# EasyEDA schematic SCH_esp32s-Camper_2025-03-08.json
TITLE: Centralita calefaccion camper; REV: 1.0; Date: 2024-12-25; Sheet: 1/1; Drawn By: Manuel Barrera; Company: MB Instal.lacions
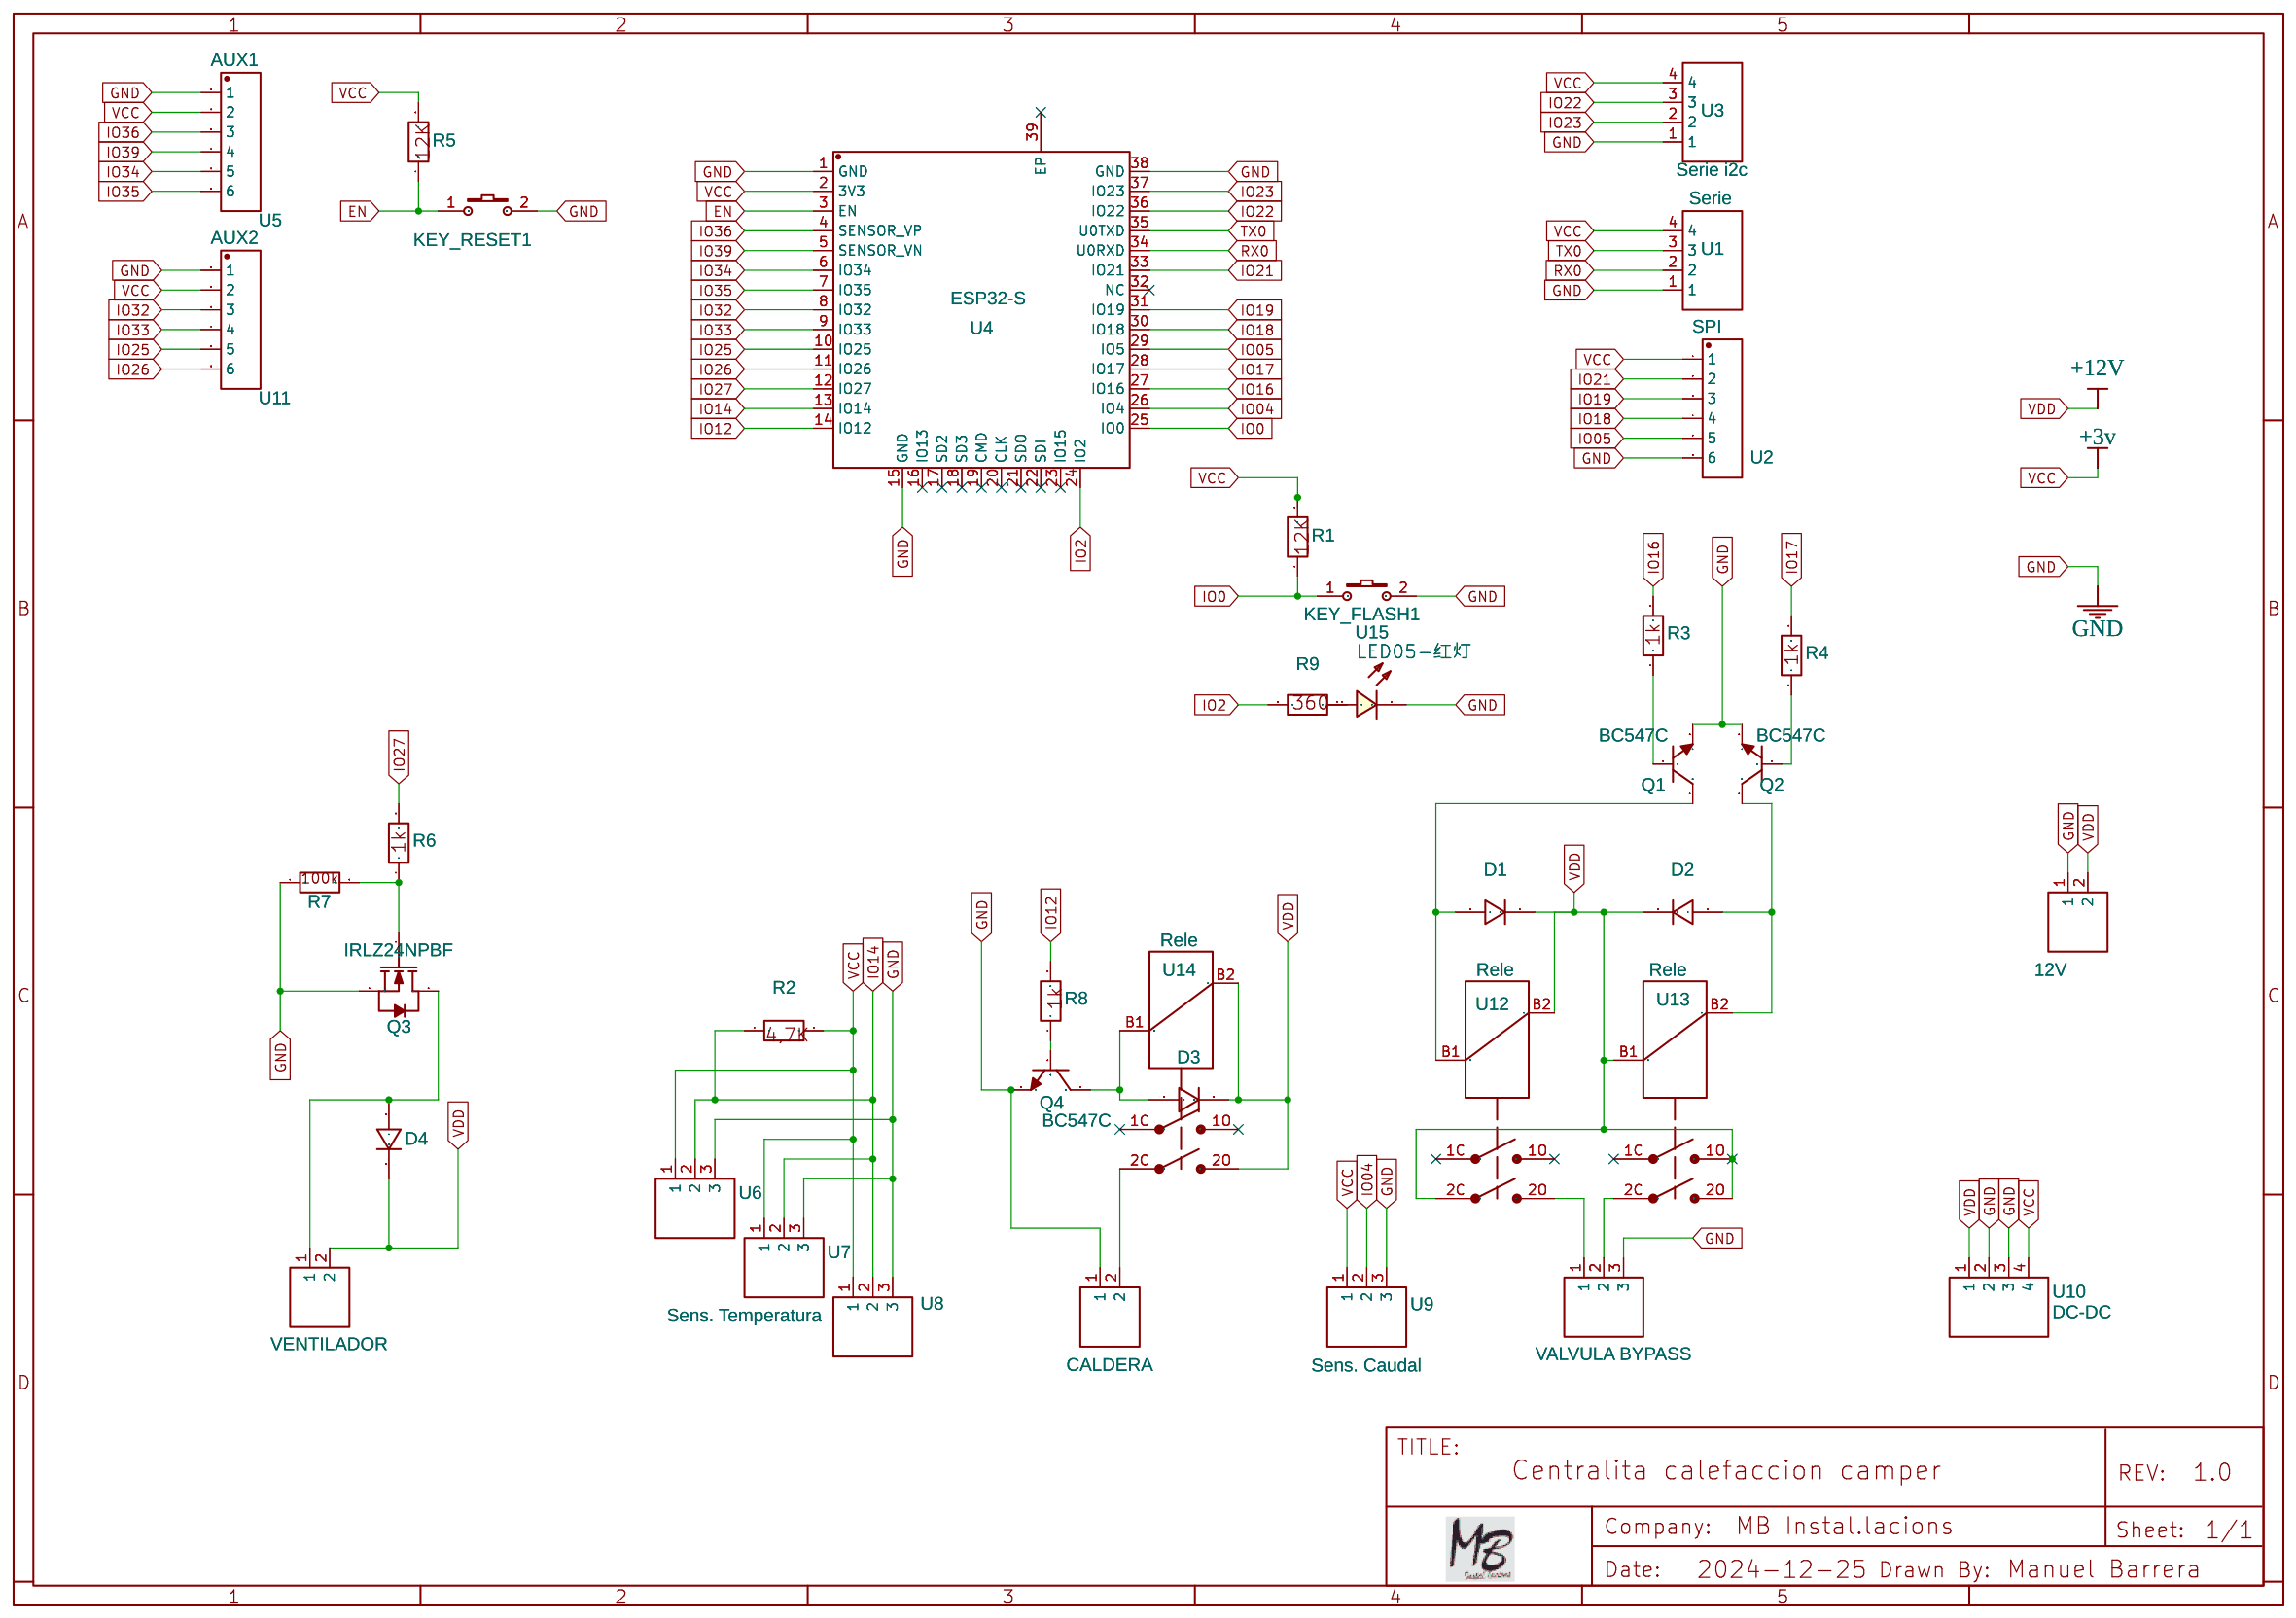
[diagram p0: schematic sheet]

## Parts
CALDERA1  CALDERA  [JST-XH02]
CALDERA2  12V  [JST-XH02]
D1  1N4007-C115999  [DO-41_BD2.4-L4.7-P8.70-D0.9-RD]
D2  1N4007-C115999  [DO-41_BD2.4-L4.7-P8.70-D0.9-RD]
D3  1N4007-C115999  [DO-41_BD2.4-L4.7-P8.70-D0.9-RD]
D4  1N4007-C115999  [DO-41_BD2.4-L4.7-P8.70-D0.9-RD]
KEY_FLASH1  K2-3.6×6.1_SMD  [KEY-SMD_2P-L6.2-W3.6-LS8.0]
KEY_RESET1  K2-3.6×6.1_SMD  [KEY-SMD_2P-L6.2-W3.6-LS8.0]
Q1  BC547C  [TO-92-3_L4.9-W3.7-P1.27-L]
Q2  BC547C  [TO-92-3_L4.9-W3.7-P1.27-L]
Q3  IRLZ24NPBF  [TO-220-3_L10.0-W4.5-P2.54-T]
Q4  BC547C  [TO-92-3_L4.9-W3.7-P1.27-L]
R1  RESISTENCIA_1/4  [RESISTENCIA_1/4S]
R2  RESISTENCIA_1/4  [RESISTENCIA_1/4S]
R3  RESISTENCIA_1/4  [RESISTENCIA_1/4S]
R4  RESISTENCIA_1/4  [RESISTENCIA_1/4S]
R5  RESISTENCIA_1/4  [RESISTENCIA_1/4S]
R6  RESISTENCIA_1/4  [RESISTENCIA_1/4S]
R7  RESISTENCIA_1/4  [RESISTENCIA_1/4S]
R8  RESISTENCIA_1/4  [RESISTENCIA_1/4S]
R9  RESISTENCIA_1/4  [RESISTENCIA_1/4S]
U1  Serie  [JST-XH04]
U2  SPI  [CONN-TH_6P-P2.50_06JQ-BT]
U3  Serie i2c  [JST-XH04]
U4  ESP32-S  [WIRELM-SMD_ESP32-S]
U5  AUX1  [CONN-TH_6P-P2.50_06JQ-BT]
U6  Sens. Temperatura  [JST-XH03]
U7  Sens. Temperatura  [JST-XH03]
U8  Sens. Temperatura  [JST-XH03]
U9  Sens. Caudal  [JST-XH03]
U10  DC-DC  [JST-XH04]
U11  AUX2  [CONN-TH_6P-P2.50_06JQ-BT]
U12  Rele  [RELE_REED-RALUX-12V-1C]
U13  Rele  [RELE_REED-RALUX-12V-1C]
U14  Rele  [RELE_REED-RALUX-12V-1C]
U15  LED05-红灯  [LED-TH_LED-3MM_RED]
VALVULA1  VALVULA BYPASS  [JST-XH03]
VENTILADOR  u9  [JST-XH02]

## Library data of the parts
CALDERA1 CALDERA2 VENTILADOR = JST-XH02: Contributor: laurent66
D1-D4 = 1N4007-C115999: Supplier Part: C115999; Supplier: LCSC; Manufacturer: PANJIT; Manufacturer Part: 1N4007; Contributor: LCSC; JLCPCB Part Class: Extended Part
KEY_FLASH1 KEY_RESET1 = K2-3.6×6.1_SMD: Supplier Part: C118141; Supplier: LCSC; Manufacturer Part: K2-1107ST-A4SW-06; Contributor: LCEDA_Lib; 制造商: 韩国韩荣
Q1 Q2 Q4 = BC547C: Supplier: LCSC; Supplier Part: C713614; Manufacturer: LGE; Contributor: LCSC; JLCPCB Part Class: Extended Part
Q3 = IRLZ24NPBF: Supplier: LCSC; Manufacturer: IR; Supplier Part: C11733; JLCPCB Part Class: Extended Part
R1-R9 = RESISTENCIA_1/4: Contributor: oscarmora872
U1 U3 U10 = JST-XH04: Contributor: laurent66
U2 U5 U11 = 06JQ-BT COPY: Contributor: LCSC; Supplier: LCSC; Supplier Part: C163023; Manufacturer: JST; Manufacturer Part: 06JQ-BT; JLCPCB Part Class: Extended Part
U4 = ESP32-S: Contributor: LCSC; Supplier: LCSC; Supplier Part: C277944; Manufacturer: Ai-Thinker(安信可); JLCPCB Part Class: Extended Part
U6-U9 VALVULA1 = JST-XH03: Contributor: laurent66
U12-U14 = Relé_REED-RALUX-12V-2C: link: https://es.aliexpress.com/item/10Pcs-Relay-Omron-LY2NJ-12V-DC-Small-relay-10A-8PIN-Coil-DPDT/32648933055.html?spm=a2g0s.9042311.0.0.274263c0VbeaKt; Contributor: salomo
U15 = LED05-红灯: Contributor: LCSC; Supplier: LCSC; Supplier Part: C9900009041; Manufacturer: null; JLCPCB Part Class: Extended Part

## Nets
+3v: R1.2 R2.2 R5.2 U1.4 U2.1 U3.4 U4.2(3V3) U5.2 U6.1 U7.1 U8.1 U9.1 U10.4 U11.2
+12V: CALDERA2.2 D1.1(C) D2.1(C) D3.1(C) D4.1(C) U10.1 U12.2C(1) U12.B2(4) U13.1O(2) U13.2O(2) U13.B1(5) U14.2O(2) U14.B2(4) VENTILADOR.2
GND: CALDERA1.1 CALDERA2.1 KEY_FLASH1.2 KEY_RESET1.2 Q1.3(E) Q2.3(E) Q3.3(S) Q4.3(E) R7.1 U1.1 U2.6 U3.1 U4.1(GND) U4.15(GND) U4.38(GND) U5.1 U6.3 U7.3 U8.3 U9.3 U10.2 U10.3 U11.1 U15.2 VALVULA1.3
EN: KEY_RESET1.1 R5.1 U4.3(EN)
IO0: KEY_FLASH1.1 R1.1 U4.25(IO0)
IO2: R9.2 U4.24(IO2)
IO04: U4.26(IO4) U9.2
IO05: U2.5 U4.29(IO5)
IO12: R8.2 U4.14(IO12)
IO14: R2.1 U4.13(IO14) U6.2 U7.2 U8.2
IO16: R3.2 U4.27(IO16)
IO17: R4.2 U4.28(IO17)
IO18: U2.4 U4.30(IO18)
IO19: U2.3 U4.31(IO19)
IO21: U2.2 U4.33(IO21)
IO22: U3.3 U4.36(IO22)
IO23: U3.2 U4.37(IO23)
IO25: U4.10(IO25) U11.5
IO26: U4.11(IO26) U11.6
IO27: R6.2 U4.12(IO27)
IO32: U4.8(IO32) U11.3
IO33: U4.9(IO33) U11.4
IO34: U4.6(IO34) U5.5
IO35: U4.7(IO35) U5.6
IO36: U4.4(SENSOR_VP) U5.3
IO39: U4.5(SENSOR_VN) U5.4
RX0: U1.2 U4.34(U0RXD)
TX0: U1.3 U4.35(U0TXD)
Net-(CALDERA1-2): CALDERA1.2 U14.2C(1)
Net-(D1-2): D1.2(A) Q1.1(C) U12.B1(5)
Net-(D2-2): D2.2(A) Q2.1(C) U13.B2(4)
Net-(D3-2): D3.2(A) Q4.1(C) U14.B1(5)
Net-(D4-2): D4.2(A) Q3.2(D) VENTILADOR.1
Net-(Q1-2): Q1.2(B) R3.1
Net-(Q2-2): Q2.2(B) R4.1
Net-(Q3-1): Q3.1(G) R6.1 R7.2
Net-(Q4-2): Q4.2(B) R8.1
Net-(R9-1): R9.1 U15.1
Net-(U12-2O): U12.2O(2) VALVULA1.1
Net-(U13-2C): U13.2C(1) VALVULA1.2

Not connected (* = marked no-connect by the designer): U4 16(IO13)* 17(SD2)* 18(SD3)* 19(CMD)* 20(CLK)* 21(SDO)* 22(SDI)* 23(IO15)* 32(NC)* 39(EP)*; U12 1C(1)* 1O(2)*; U13 1C(1)*; U14 1C(1)* 1O(2)*
